# EasyEDA Pro project OptoGrid_V0.05.epro, schematic OptoGrid_Main_V0.05

## Sheets
1 MCU: Board Name: OptoGrid_Main_V0.05; Create Date: 2025-07-05; Page Name: MCU; Project Name: OptoGrid_V0.05; Schematic Name: OptoGrid_Main_V0.05; Update Date: 2025-09-04; Company: 嘉立创EDA; Drawed: Fukui (Daniel) Yang; Page Size: A4; Version: V1.0
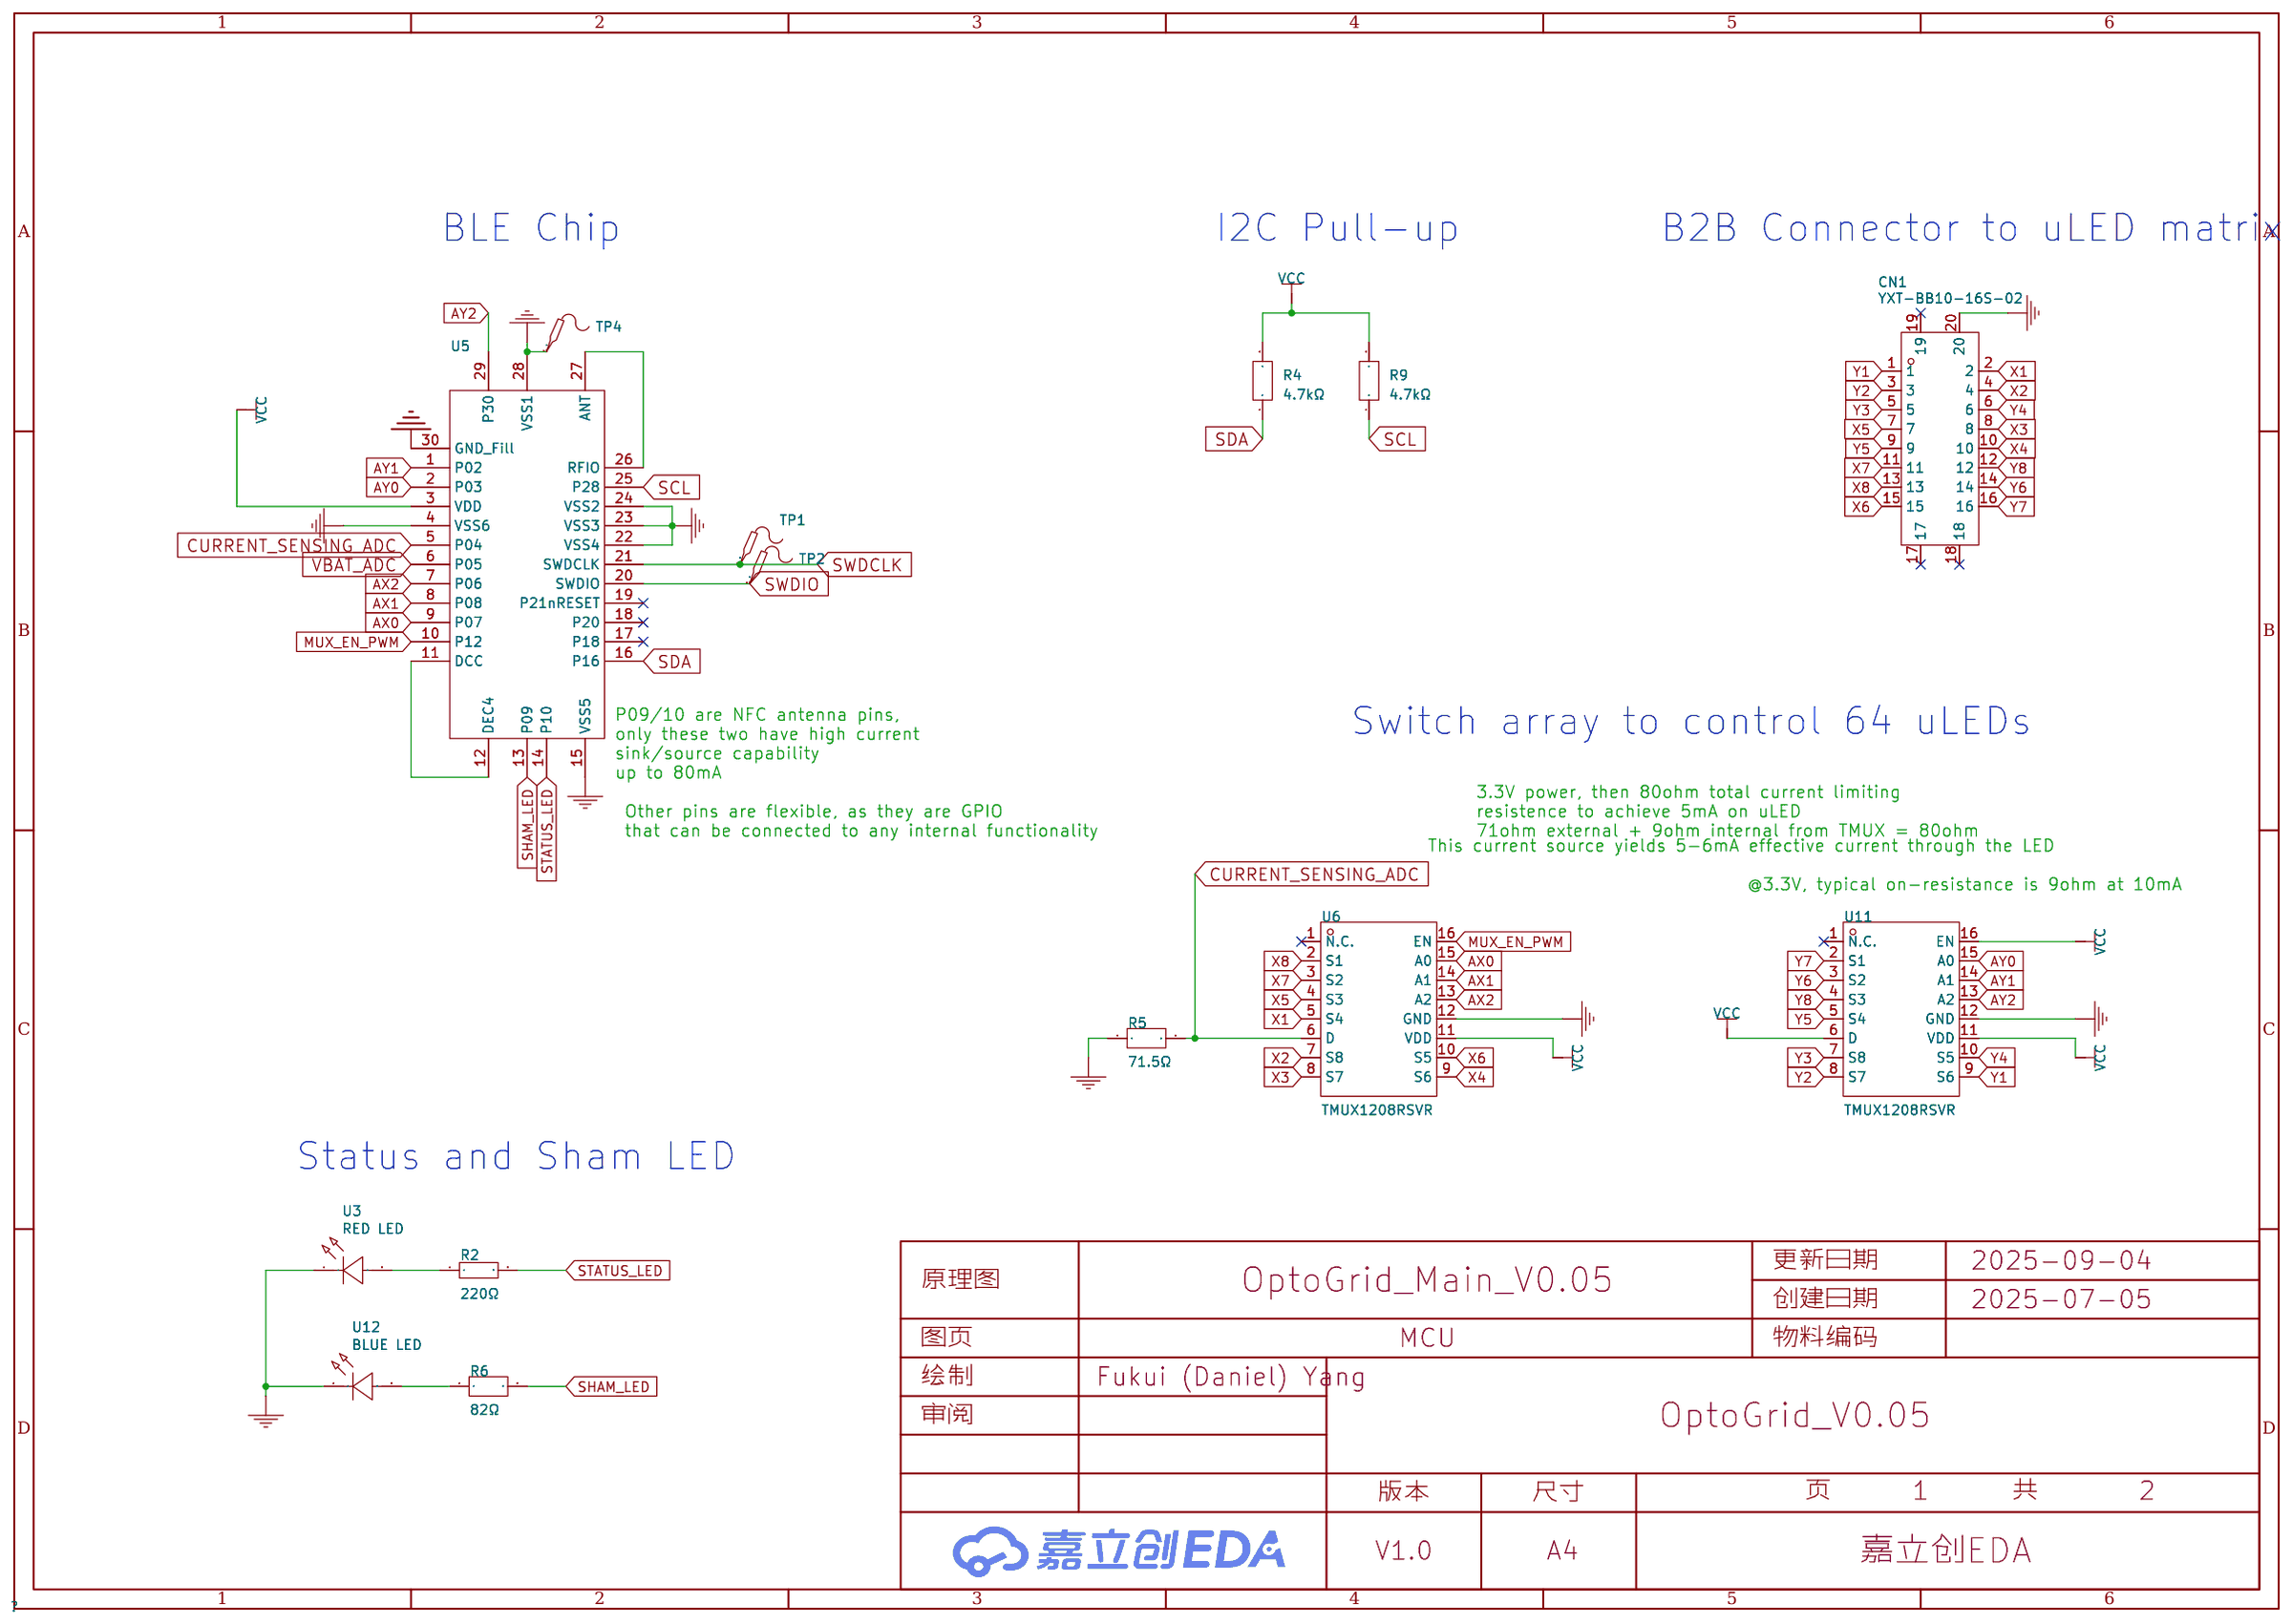
[diagram p1: MCU]
2 Power: Page Name: Power
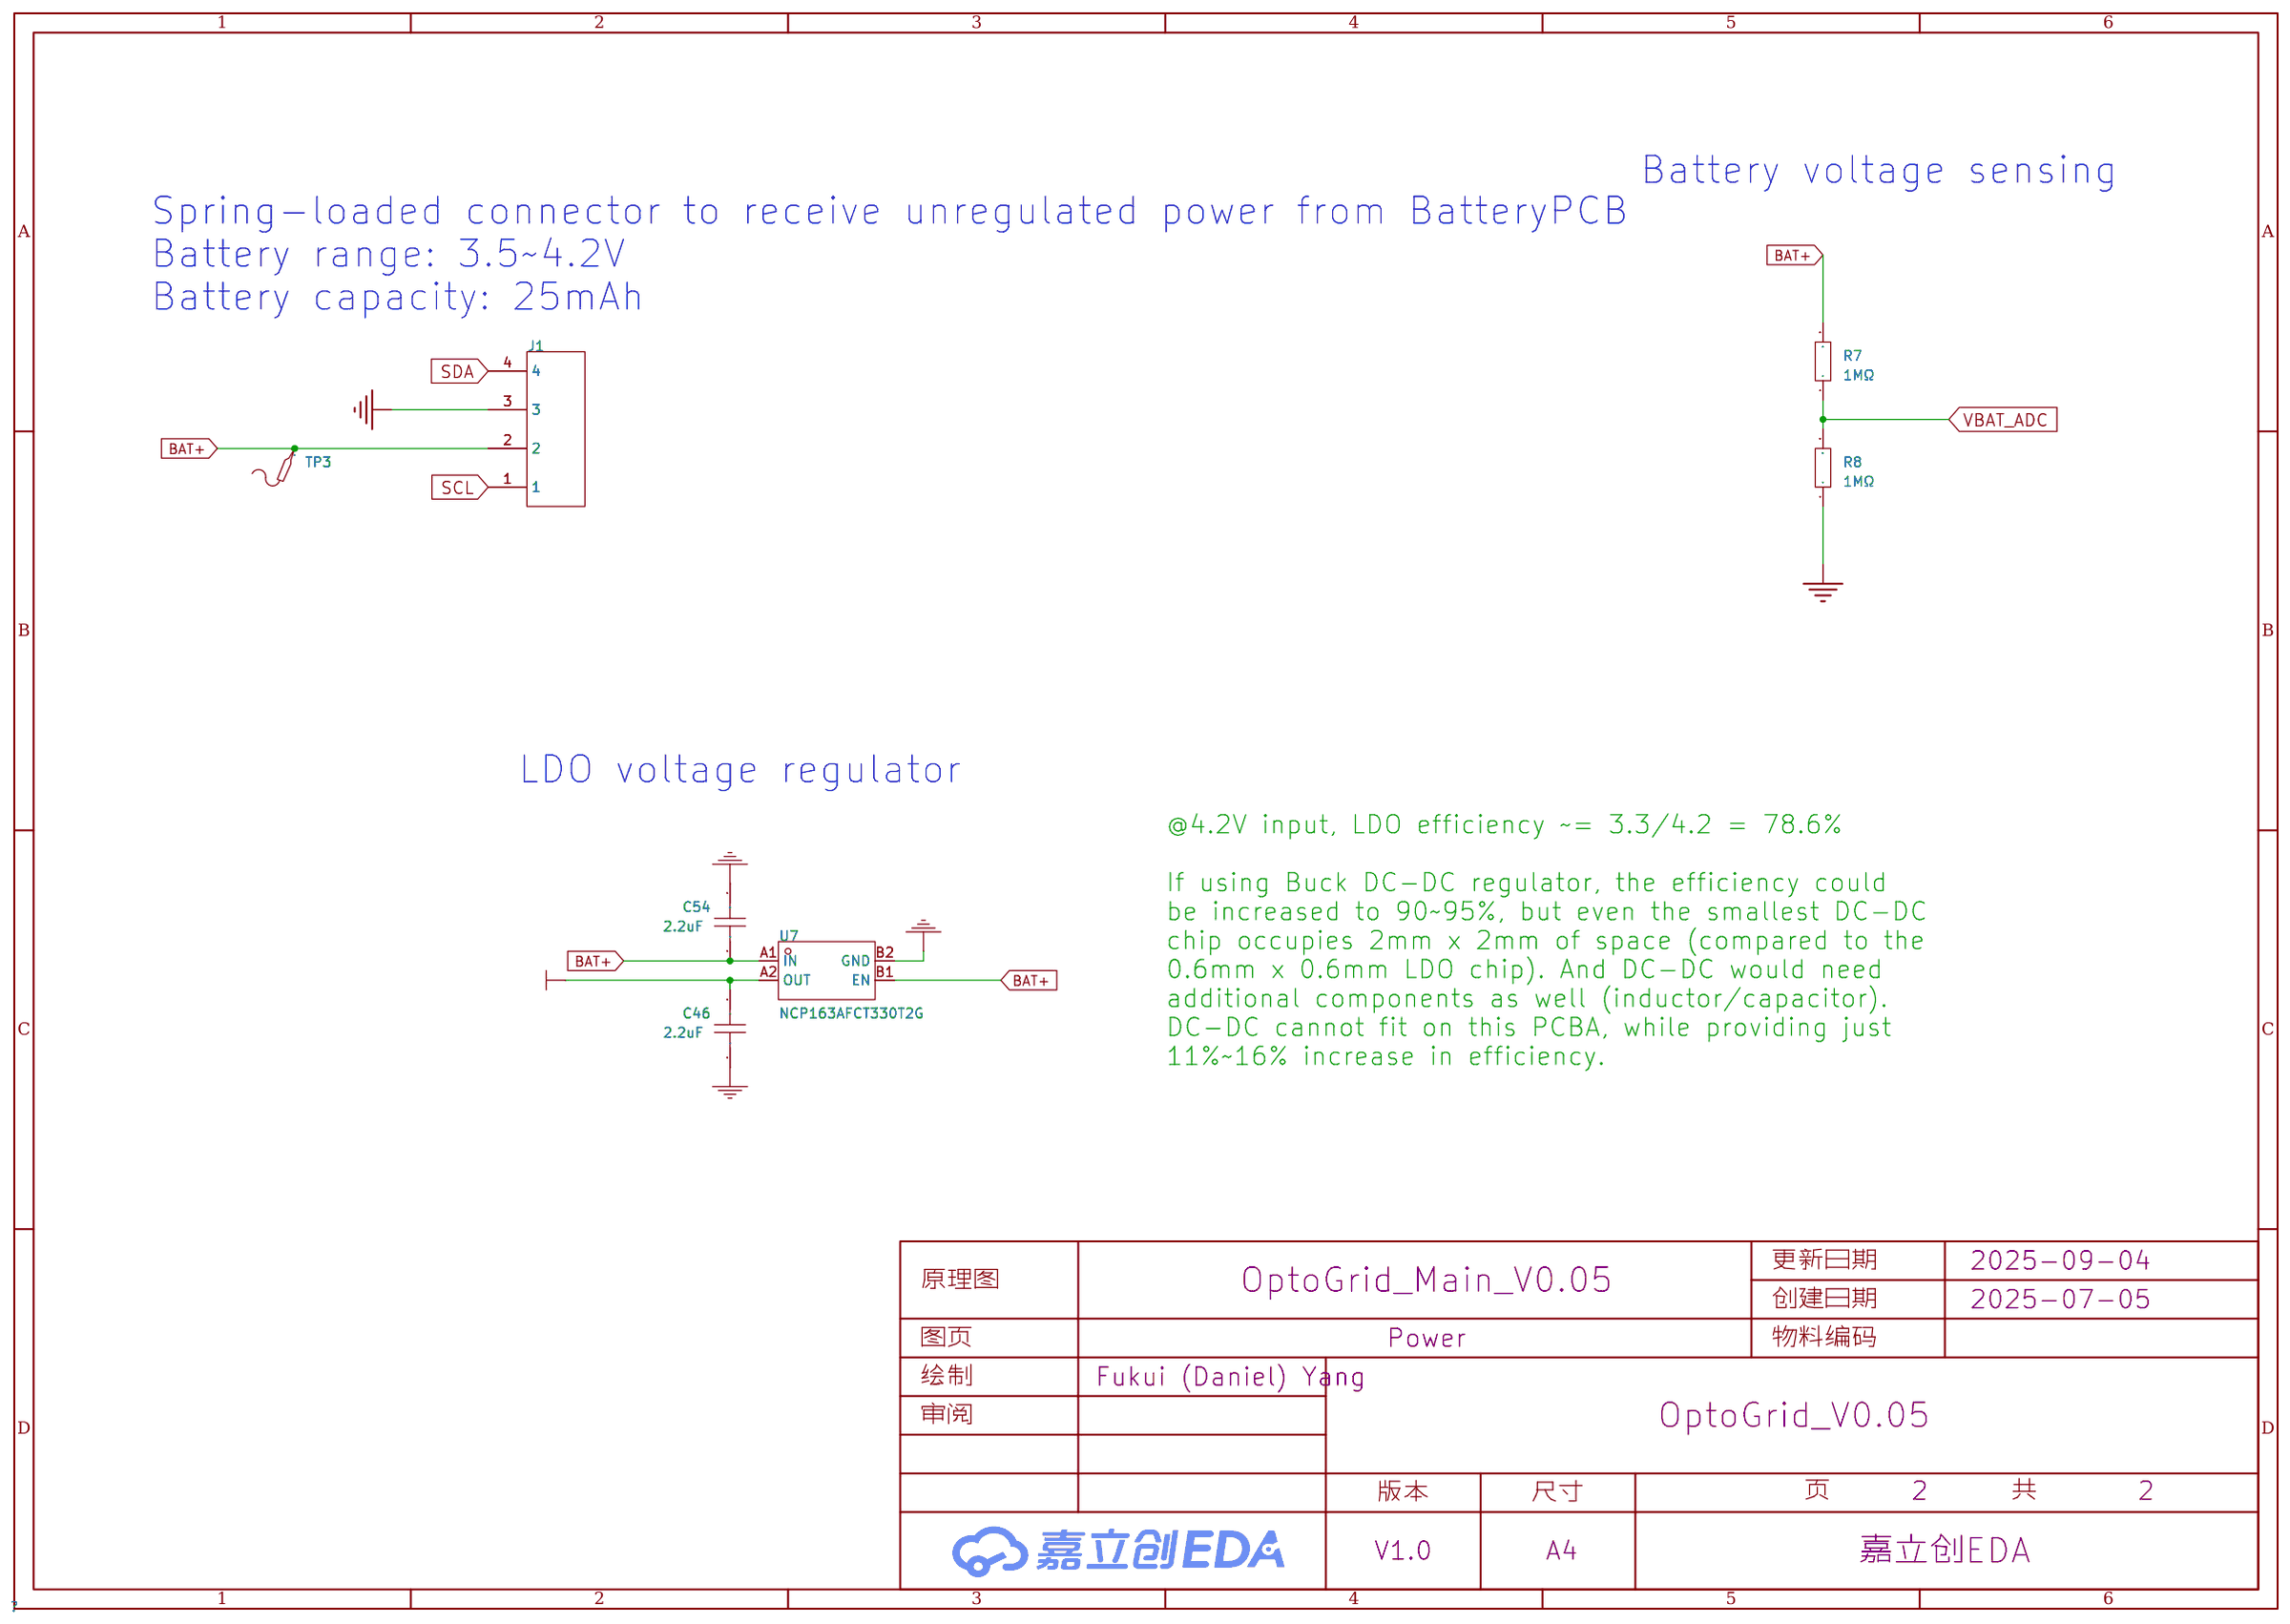
[diagram p2: Power]

## Parts
sheet MCU
CN1  YXT-BB10-16S-02  [CONN-SMD_YXT-BB10-16S-02]
R2  220Ω  [R0201]
R4  4.7kΩ  [R0201]
R5  71.5Ω  [R0201]
R6  82Ω  [R0201]
R9  4.7kΩ  [R0201]
TP1  -  [Test-Point-0.5mm]
TP2  -  [Test-Point-0.5mm]
TP4  -  [Test-Point-0.5mm]
U3  RED LED  [BLUE_LED_KINGBRIGHT_0201]
U5  -  [HY0020_footprint_NoFilling]
U6  TMUX1208RSVR  [UTQFN-16_L2.6-W1.8-P0.40-BL]
U11  TMUX1208RSVR  [UTQFN-16_L2.6-W1.8-P0.40-BL]
U12  BLUE LED  [BLUE_LED_KINGBRIGHT_0201]
sheet Power
C46  2.2uF  [C0201]
C54  2.2uF  [C0201]
J1  -  [811-22-004-30-002101]
R7  1MΩ  [R0201]
R8  1MΩ  [R0201]
TP3  -  [Test-Point-0.5mm]
U7  NCP163AFCT330T2G  [WLCSP-4_L0.6-W0.6-P0.35-R2-C2-TL]

## Library data of the parts
CN1 = YXT-BB10-16S-02: Supplier: LCSC; Supplier Part: C2763964; Manufacturer: YXT(益鑫通）; JLCPCB Part Class: Extended Part
R2 = RC0201FR-07220RL: 电阻类型:厚膜电阻;阻值:220Ω;精度:±1%;功率:50mW;最大工作电压:25V;温度系数:±200ppm/℃;; LCSC Part Name: 厚膜电阻 220Ω ±1% 50mW; Supplier Part: C274342; Manufacturer: YAGEO(国巨); Supplier Footprint: 0201; JLCPCB Part Class: 扩展库; Datasheet: https://atta.szlcsc.com/upload/public/pdf/source/20180821/C275644_0D56F95EFF785E7D9A1FEF436B37DA78.pdf; Supplier: LCSC; Type: 厚膜电阻; Tolerance: ±1%; Power(Watts): 50mW; Overload Voltage (Max): 25V; Temperature Coefficient: ±200ppm/℃; Operating Temperature Range: -55℃~+125℃
R4 R9 = AF0201FR-074K7L: 电阻类型:厚膜电阻;阻值:4.7kΩ;精度:±1%;功率:50mW;最大工作电压:25V;温度系数:±200ppm/℃;; LCSC Part Name: 厚膜电阻 4.7kΩ ±1% 50mW; Supplier Part: C2105831; Manufacturer: YAGEO(国巨); Supplier Footprint: 0201; JLCPCB Part Class: 扩展库; Datasheet: https://atta.szlcsc.com/upload/public/pdf/source/20210712/C2105831_B7E5D2600BF229B29F1C9CE0CCE2B3D7.pdf; Supplier: LCSC; Type: 厚膜电阻; Tolerance: ±1%; Power(Watts): 50mW; Overload Voltage (Max): 25V; Temperature Coefficient: ±200ppm/℃; Operating Temperature Range: -55℃~+125℃
R5 = 0201WMF715JTEE: 电阻类型:厚膜电阻;阻值:71.5Ω;精度:±1%;功率:50mW;最大工作电压:25V;温度系数:±200ppm/℃;; LCSC Part Name: 71.5Ω ±1% 50mW 厚膜电阻; Supplier Part: C423441; Manufacturer: UNI-ROYAL(厚声); Supplier Footprint: 0201; JLCPCB Part Class: 扩展库; Datasheet: https://atta.szlcsc.com/upload/public/pdf/source/20200306/C422600_1E6D84923E4A46A82E41ADD87F860B5C.pdf; Supplier: LCSC; Type: 厚膜电阻; Tolerance: ±1%; Power(Watts): 50mW; Overload Voltage (Max): 25V; Temperature Coefficient: ±200ppm/℃; Operating Temperature Range: -55℃~+155℃
R6 = NQ01WMJ0820TEE: 阻值:82Ω;精度:±5%;功率:50mW;最大工作电压:50V;温度系数:±200ppm/℃;; LCSC Part Name: 82Ω ±5% 50mW; Supplier Part: C321062; Manufacturer: FH; Manufacturer Part: RC-01W82R0FT; Supplier Footprint: 0201; JLCPCB Part Class: 扩展库; Datasheet: https://atta.szlcsc.com/upload/public/pdf/source/20200826/C778391_130F7848FE812F64BEA6E556F7D5CD0C.pdf; Supplier: LCSC; Tolerance: ±5%; Power(Watts): 50mW; Overload Voltage (Max): 50V; Temperature Coefficient: ±200ppm/℃; Operating Temperature Range: -55℃~+155℃
TP1-TP4 = Test-Point: Test Point 测试点
U3 = APG0603CGC-TT: Supplier: LCSC; Supplier Part: C5356830; Manufacturer: Kingbright; Manufacturer Part: APG0603SURC-TT; JLCPCB Part Class: Extended Part
U5 = HY0020
U6 U11 = TMUX1208RSVR: 开关电路:-;; Supplier Part: C2673274; Manufacturer: TI(德州仪器); Supplier Footprint: UTQFN-16(1.8x2.6); JLCPCB Part Class: 扩展库; Datasheet: https://www.ti.com/cn/lit/gpn/tmux1208; Supplier: LCSC
U12 = APG0603CGC-TT: Supplier: LCSC; Supplier Part: C5846953; Manufacturer: Kingbright; Manufacturer Part: APG0603VBC-A1-5MAV; JLCPCB Part Class: Extended Part
C46 C54 = GRM033R61A225KE47D: 容值:2.2uF;精度:±10%;额定电压:10V;材质(温度系数):X5R;; LCSC Part Name: 2.2uF ±10% 10V; Supplier Part: C335106; Manufacturer: muRata(村田); Supplier Footprint: 0201; JLCPCB Part Class: 扩展库; Datasheet: https://atta.szlcsc.com/upload/public/pdf/source/20200305/C490387_23319AE8C154DEB24C505E6C82A8106A.pdf; Supplier: LCSC; Tolerance: ±10%; Voltage Rated: 10V; Temperature Coefficient: X5R
J1 = 811-22-004-30-002101: Mill-Max Mfg. Corp. 811-22-004-30-002101 / JLCPCB Part #:C29643123; Supplier: LC; Supplier Part: C29643123; Manufacturer: Mill-Max
R7 R8 = RC0201FR-071ML: 电阻类型:厚膜电阻;阻值:1MΩ;精度:±1%;功率:50mW;最大工作电压:25V;温度系数:±200ppm/℃;; LCSC Part Name: 厚膜电阻 1MΩ ±1% 50mW; Supplier Part: C295786; Manufacturer: YAGEO(国巨); Supplier Footprint: 0201; JLCPCB Part Class: 扩展库; Datasheet: https://atta.szlcsc.com/upload/public/pdf/source/20181009/C309620_DA5935B6E1D48212CB7A533FE518B3C2.pdf; Supplier: LCSC; Type: 厚膜电阻; Tolerance: ±1%; Power(Watts): 50mW; Overload Voltage (Max): 25V; Temperature Coefficient: ±200ppm/℃; Operating Temperature Range: -55℃~+125℃
U7 = NCP163AFCT330T2G: 输出类型:-;; LCSC Part Name: LDO 稳压器，250 mA，超高 PSRR，超低噪音; Supplier Part: C603648; Manufacturer: onsemi(安森美); Supplier Footprint: WLCSP-4; JLCPCB Part Class: 扩展库; Datasheet: https://atta.szlcsc.com/upload/public/pdf/source/20200927/C603657_74821F5CD7CAE943477E5F5DC4975E14.pdf; Supplier: LCSC

## Nets
GND: C46.1 C54.2 CN1.20 J1.3 R5.1 R8.1 TP4.1 U3.1(K) U5.4(VSS6) U5.15(VSS5) U5.22(VSS4) U5.23(VSS3) U5.24(VSS2) U5.28(VSS1) U5.30(GND_Fill) U6.12(GND) U7.B2(GND) U11.12(GND) U12.1(K)
VBAT_ADC: R7.1 R8.2 U5.6(P05)
VCC: C46.2 R4.2 R9.2 U5.3(VDD) U6.11(VDD) U7.A2(OUT) U11.6(D) U11.11(VDD) U11.16(EN)
AX0: U5.9(P07) U6.15(A0)
AX1: U5.8(P08) U6.14(A1)
AX2: U5.7(P06) U6.13(A2)
AY0: U5.2(P03) U11.15(A0)
AY1: U5.1(P02) U11.14(A1)
AY2: U5.29(P30) U11.13(A2)
BAT+: C54.1 J1.2 R7.2 TP3.1 U7.A1(IN) U7.B1(EN)
CURRENT_SENSING_ADC: R5.2 U5.5(P04) U6.6(D)
MUX_EN_PWM: U5.10(P12) U6.16(EN)
SCL: J1.1 R9.1 U5.25(P28)
SDA: J1.4 R4.1 U5.16(P16)
SHAM_LED: R6.2 U5.13(P09)
STATUS_LED: R2.2 U5.14(P10)
SWDCLK: TP1.1 U5.21(SWDCLK)
SWDIO: TP2.1 U5.20(SWDIO)
X1: CN1.2 U6.5(S4)
X2: CN1.4 U6.7(S8)
X3: CN1.8 U6.8(S7)
X4: CN1.10 U6.9(S6)
X5: CN1.7 U6.4(S3)
X6: CN1.15 U6.10(S5)
X7: CN1.11 U6.3(S2)
X8: CN1.13 U6.2(S1)
Y1: CN1.1 U11.9(S6)
Y2: CN1.3 U11.8(S7)
Y3: CN1.5 U11.7(S8)
Y4: CN1.6 U11.10(S5)
Y5: CN1.9 U11.5(S4)
Y6: CN1.14 U11.3(S2)
Y7: CN1.16 U11.2(S1)
Y8: CN1.12 U11.4(S3)
$1N29965: U5.26(RFIO) U5.27(ANT)
$1N29971: U5.11(DCC) U5.12(DEC4)
$1N46797: R2.1 U3.2(A)
$1N46842: R6.1 U12.2(A)

Not connected (* = marked no-connect by the designer): CN1 17* 18* 19*; U5 17(P18)* 18(P20)* 19(P21nRESET)*; U6 1(N.C.)*; U11 1(N.C.)*

## Notes on the sheets
sheet 1
- BLE Chip
- I2C Pull-up
- B2B Connector to uLED matrix
- P09/10 are NFC antenna pins,
  only these two have high current
  sink/source capability
  up to 80mA
- Switch array to control 64 uLEDs
- 3.3V power, then 80ohm total current limiting
  resistence to achieve 5mA on uLED
  71ohm external + 9ohm internal from TMUX = 80ohm
- Other pins are flexible, as they are GPIO
  that can be connected to any internal functionality
- This current source yields 5-6mA effective current through the LED
- @3.3V, typical on-resistance is 9ohm at 10mA
- Status and Sham LED
sheet 2
- Spring-loaded connector to receive unregulated power from BatteryPCB
  Battery range: 3.5~4.2V
  Battery capacity: 25mAh
- Battery voltage sensing
- LDO voltage regulator
- @4.2V input, LDO efficiency ~= 3.3/4.2 = 78.6%
  If using Buck DC-DC regulator, the efficiency could
  be increased to 90~95%, but even the smallest DC-DC
  chip occupies 2mm x 2mm of space (compared to the
  0.6mm x 0.6mm LDO chip). And DC-DC would need
  additional components as well (inductor/capacitor).
  DC-DC cannot fit on this PCBA, while providing just
  11%~16% increase in efficiency.
